# Altium schematic sheet modFOC-Sensing.SchDoc
size A4; DocumentNumber: 2; SheetNumber: 2; SheetTotal: 3
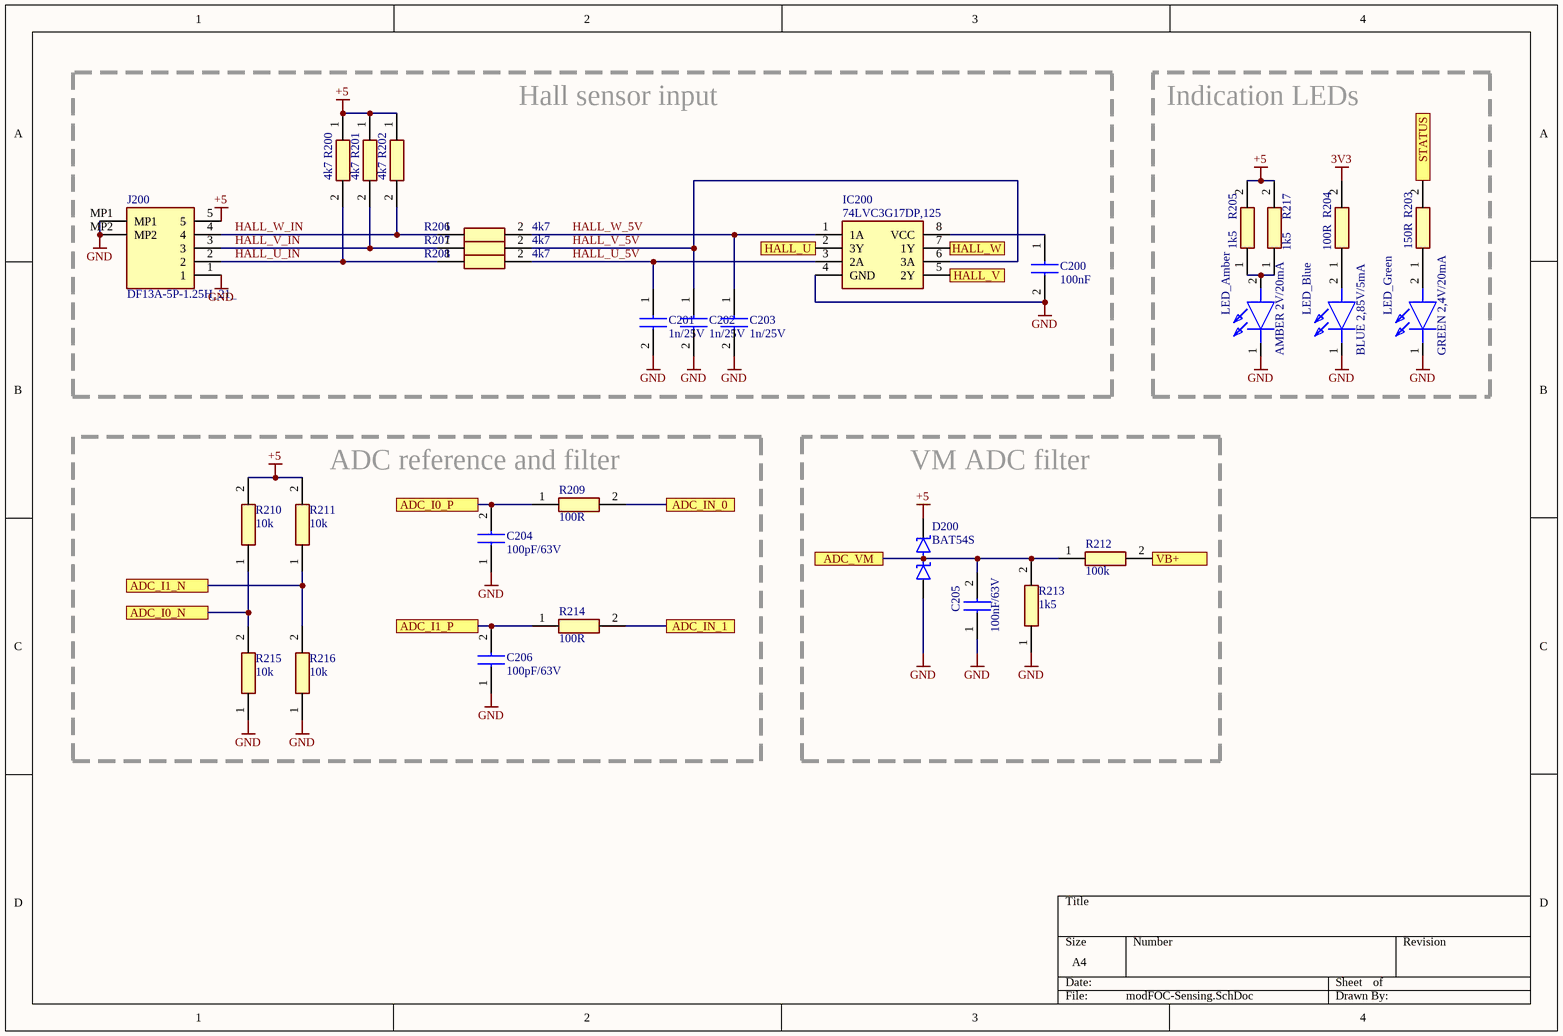
[diagram p0: modFOC-Sensing.SchDoc]

## Parts
C200  100nF  [CAPC1608X97N]
C201  1n/25V  [CAPC1608X97N]
C202  1n/25V  [CAPC1608X97N]
C203  1n/25V  [CAPC1608X97N]
C204  100pF/63V  [CAPC1608X87N]
C205  100nF/63V  [CAPC1608X97N]
C206  100pF/63V  [CAPC1608X87N]
D200  BAT54S  [SOT95P240X110-3N]
IC200  74LVC3G17DP,125  [SOP65P400X110-8N]
J200  DF13A-5P-1.25H_21_  [DF13A5P125H21]
LED_Amber  AMBER 2V/20mA  [LEDC1608X55N]
LED_Blue  BLUE 2,85V/5mA  [LEDC1608X40N]
LED_Green  GREEN 2,4V/20mA  [LGQ396PS35]
R200  4k7  [RESC1608X55N]
R201  4k7  [RESC1608X55N]
R202  4k7  [RESC1608X55N]
R203  150R  [RESC1608X55N]
R204  100R  [RESC1608X55N]
R205  1k5  [RESC1608X55N]
R206  4k7  [RESC1608X55N]
R207  4k7  [RESC1608X55N]
R208  4k7  [RESC1608X55N]
R209  100R  [RESC1608X55N]
R210  10k  [RESC1608X55N]
R211  10k  [RESC1608X55N]
R212  100k  [RESC1608X55N]
R213  1k5  [RESC1608X55N]
R214  100R  [RESC1608X55N]
R215  10k  [RESC1608X55N]
R216  10k  [RESC1608X55N]
R217  1k5  [RESC1608X55N]

## Blocks framed on the sheet
Hall sensor input: C200-C203 IC200 J200 R200-R202 R206-R208
Indication LEDs: LED_Amber LED_Blue LED_Green R203-R205 R217
ADC reference and filter: C204 C206 R209-R211 R214-R216
VM ADC filter: C205 D200 R212 R213

## Ports
ADC_I0_N, ADC_I0_P, ADC_I1_N, ADC_I1_P, ADC_IN_0, ADC_IN_1, ADC_VM, HALL_U, HALL_V, HALL_W, STATUS, VB+

## Nets
3V3: R204.2
+5: D200.2(K) J200.5 R200.1 R201.1 R202.1 R205.2 R210.2 R211.2 R217.2
GND: C200.2 C201.2 C202.2 C203.2 C204.1 C205.1 C206.1 D200.1(A) IC200.4(GND) J200.1 J200.MP1 J200.MP2 LED_Amber.1(K) LED_Blue.1(K) LED_Green.1(K) R213.1 R215.1 R216.1
ADC_I0_N: R210.1 R215.2 ; port ADC_I0_N
ADC_I0_P: C204.2 R209.1 ; port ADC_I0_P
ADC_I1_N: R211.1 R216.2 ; port ADC_I1_N
ADC_I1_P: C206.2 R214.1 ; port ADC_I1_P
ADC_IN_0: R209.2 ; port ADC_IN_0
ADC_IN_1: R214.2 ; port ADC_IN_1
ADC_VM: C205.2 D200.3(A/K) R212.1 R213.2 ; port ADC_VM
HALL_U: IC200.2(3Y) ; port HALL_U
HALL_U_5V: C201.1 IC200.3(2A) R208.2
HALL_U_IN: J200.2 R200.2 R208.1
HALL_V: IC200.5(2Y) ; port HALL_V
HALL_V_5V: C202.1 IC200.6(3A) R207.2
HALL_V_IN: J200.3 R201.2 R207.1
HALL_W: IC200.7(1Y) ; port HALL_W
HALL_W_5V: C203.1 IC200.1(1A) R206.2
HALL_W_IN: J200.4 R202.2 R206.1
STATUS: R203.2 ; port STATUS
VB+: R212.2 ; port VB+
NetC200_1: C200.1 IC200.8(VCC)
NetLED_Amber_2: LED_Amber.2(A) R205.1 R217.1
NetLED_Blue_2: LED_Blue.2(A) R204.1
NetLED_Green_2: LED_Green.2(A) R203.1

## Library data of the parts
C200 = VJ0603Y104JXJAC: Capacitor; Manufacturer_Name: Vishay; Datasheet Link: http://www.vishay.com/docs/45226/vj31xrohsautomlcc.pdf; Height: 0.97mm; Manufacturer_Part_Number: VJ0603Y104JXJAC; Mouser Part Number: 77-VJ0603Y104JXJAC; Mouser Price/Stock: https://www.mouser.com/Search/Refine.aspx?Keyword=77-VJ0603Y104JXJAC
C201-C203 = GRM033R71E102KA01D: Capacitor; Manufacturer_Name: Murata Electronics; Datasheet Link: https://psearch.en.murata.com/capacitor/product/GRM033R71E102KA01%23.html; Height: 0.33mm; Manufacturer_Part_Number: GRM033R71E102KA01D; Mouser Part Number: 81-GRM033R71E102KA1D; Mouser Price/Stock: https://www.mouser.co.uk/ProductDetail/Murata-Electronics/GRM033R71E102KA01D/?qs=%252BwCMEOx2S5vqymn%2Fc34U1A%3D%3D; Arrow Part Number: GRM033R71E102KA01D; Arrow Price/Stock: https://www.arrow.com/en/products/grm033r71e102ka01d/murata-manufacturing
C204 C206 = C0603C101K1HACTU: Capacitor; Manufacturer_Name: Kemet; Datasheet Link: https://www.mouser.com/datasheet/2/212/KEM_C1007_X8R_ULTRA_150C_SMD-1102703.pdf; Height: 0.87mm; Manufacturer_Part_Number: C0603C101K1HACTU; Mouser Part Number: 80-C0603C101K1HACTU; Mouser Price/Stock: https://www.mouser.co.uk/ProductDetail/KEMET/C0603C101K1HACTU?qs=W0yvOO0ixfE5G01qpfeqIQ%3D%3D
C205 = C0805C104MMREC7210: Capacitor; Manufacturer_Name: Vishay; Manufacturer_Part_Number: VJ0603Y104JXJAC; Datasheet Link: http://www.vishay.com/docs/45226/vj31xrohsautomlcc.pdf; Height: 1mm; Mouser Part Number: 77-VJ0603Y104JXJAC; Mouser Price/Stock: https://www.mouser.com/Search/Refine.aspx?Keyword=77-VJ0603Y104JXJAC
D200 = BAT54S: Schottky Diode; Manufacturer_Name: Rectron; Datasheet Link: https://www.rectron.com/data_sheets/bat54s.pdf; Height: 1.1mm; Manufacturer_Part_Number: BAT54S; Mouser Part Number: 583-BAT54S; Mouser Price/Stock: https://www.mouser.co.uk/ProductDetail/Rectron/BAT54S?qs=7pEAo90IqNGRiqD7TkybWA%3D%3D; Arrow Part Number: BAT54S; Arrow Price/Stock: https://www.arrow.com/en/products/bat54s/rectron
IC200 = 74LVC3G17DP,125: Integrated Circuit; Manufacturer_Name: Nexperia; Datasheet Link: https://assets.nexperia.com/documents/data-sheet/74LVC3G17.pdf; Height: 1.1mm; Manufacturer_Part_Number: 74LVC3G17DP,125; Mouser Part Number: 771-LVC3G17DP125; Mouser Price/Stock: https://www.mouser.co.uk/ProductDetail/Nexperia/74LVC3G17DP125?qs=me8TqzrmIYUUngWcw0uHGA%3D%3D; Arrow Part Number: 74LVC3G17DP,125; Arrow Price/Stock: https://www.arrow.com/en/products/74lvc3g17dp125/nexperia
J200 = DF13A-5P-1.25H_21_: Connector; Manufacturer_Name: Hirose; Manufacturer_Part_Number: DF13A-5P-1.25H(21); Datasheet Link: https://componentsearchengine.com/Datasheets/1/DF13A-5P-1.25H(21).pdf; Height: 3.75mm; Mouser Part Number: 798-DF13A5P125H21; Mouser Price/Stock: https://www.mouser.co.uk/ProductDetail/Hirose-Connector/DF13A-5P-125H21?qs=XQjbzJWzFPWvJsE2o%252B4Q8Q%3D%3D
LED_Amber = ASMT-RA45-AP932: LED; Manufacturer_Name: Avago Technologies; Datasheet Link: https://docs.broadcom.com/docs/AV02-0378EN; Height: 0.55mm; Manufacturer_Part_Number: ASMT-RA45-AP932; Mouser Part Number: 630-ASMT-RA45-AP932; Mouser Price/Stock: https://www.mouser.co.uk/ProductDetail/Broadcom-Avago/ASMT-RA45-AP932?qs=7zQgkplsu%2FO5gZneoB42ug%3D%3D
LED_Blue = LB_Q39G-L2OO-35-1: LED; Manufacturer_Name: OSRAM; Manufacturer_Part_Number: LB Q39G-L2OO-35-1; Datasheet Link: http://www.mouser.com/ds/2/311/LB Q39G - CHIPLED 0603-553388.pdf; Height: 0.4mm; Mouser Part Number: 720-LBQ39GL2N2351; Mouser Price/Stock: https://www.mouser.co.uk/ProductDetail/OSRAM-Opto-Semiconductors/LB-Q39G-L2OO-35-1?qs=74fRo9GAWsxvZBH6a5xY%252BA%3D%3D; Arrow Part Number: LB Q39G-L2OO-35-1; Arrow Price/Stock: https://www.arrow.com/en/products/lbq39g-l2oo-35-1/osram-opto-semiconductors
LED_Green = LG_Q396-PS-35: LED; Manufacturer_Name: OSRAM; Manufacturer_Part_Number: LG Q396-PS-35; Datasheet Link: https://mouser.componentsearchengine.com/Datasheets/2/LG%20Q396-PS-35.pdf; Height: 0.4mm; Mouser Part Number: 720-LGQ396A3964; Mouser Price/Stock: https://www.mouser.co.uk/ProductDetail/OSRAM-Opto-Semiconductors/LG-Q396-PS-35?qs=xC%252BE9h5iuX5%252BCocujXxOpw%3D%3D; Arrow Part Number: LG Q396-PS-35; Arrow Price/Stock: https://www.arrow.com/en/products/lgq396-ps-35/osram-opto-semiconductors
R200-R202 R206-R208 = CRCW06034K70JNEAC: Resistor; Manufacturer_Name: Vishay; Datasheet Link: http://www.vishay.com/docs/28773/crcwce3.pdf; Height: 0.55mm; Manufacturer_Part_Number: CRCW06034K70JNEAC; Mouser Part Number: 71-CRCW06034K70JNEAC; Mouser Price/Stock: https://www.mouser.co.uk/ProductDetail/Vishay-Dale/CRCW06034K70JNEAC/?qs=E3Y5ESvWgWMzBuUf0K3dnA%3D%3D; Arrow Part Number: CRCW06034K70JNEAC; Arrow Price/Stock: https://www.arrow.com/en/products/crcw06034k70jneac/vishay
R203 = SFR03EZPF1500: Resistor; Manufacturer_Name: ROHM Semiconductor; Datasheet Link: https://componentsearchengine.com/Datasheets/1/SFR03EZPF1500.pdf; Height: 0.55mm; Manufacturer_Part_Number: SFR03EZPF1500; Mouser Part Number: 755-SFR03EZPF1500; Mouser Price/Stock: https://www.mouser.com/Search/Refine.aspx?Keyword=755-SFR03EZPF1500
R204 R209 R214 = CRCW0603100RFKEAC: Resistor; Manufacturer_Name: Vishay; Datasheet Link: https://componentsearchengine.com/Datasheets/1/CRCW0603100RFKEAC.pdf; Height: 0.55mm; Manufacturer_Part_Number: CRCW0603100RFKEAC; Mouser Part Number: 71-CRCW0603100RFKEAC; Mouser Price/Stock: https://www.mouser.co.uk/ProductDetail/Vishay-Dale/CRCW0603100RFKEAC/?qs=E3Y5ESvWgWPJqb4%2F19sAKw%3D%3D; Arrow Part Number: CRCW0603100RFKEAC; Arrow Price/Stock: https://www.arrow.com/en/products/crcw0603100rfkeac/vishay
R205 R213 R217 = ERJ1GNF1501C: Resistor; Manufacturer_Name: Panasonic; Datasheet Link: https://industrial.panasonic.com/cdbs/www-data/pdf/RDA0000/AOA0000C84.pdf; Height: 0.26mm; Manufacturer_Part_Number: ERJ1GNF1501C
R210 R211 R215 R216 = RC0603FR-0710KL: Resistor; Manufacturer_Name: YAGEO (PHYCOMP); Datasheet Link: http://www.yageo.com/documents/recent/PYu-RC0603_51_RoHS_L_v5.pdf; Height: 0.55mm; Manufacturer_Part_Number: RC0603FR-0710KL; Arrow Part Number: RC0603FR-0710KL; Arrow Price/Stock: https://www.arrow.com/en/products/rc0603fr-0710kl/yageo; Mouser Part Number: 603-RC0603FR-0710KL; Mouser Price/Stock: https://www.mouser.co.uk/ProductDetail/Yageo/RC0603FR-0710KL?qs=grNVn54RoB%252B3GtjbJj3wJQ%3D%3D
R212 = ERJ1GNF1003C: Resistor; Manufacturer_Name: Panasonic; Datasheet Link: https://industrial.panasonic.com/cdbs/www-data/pdf/RDA0000/AOA0000C84.pdf; Height: 0.26mm; Manufacturer_Part_Number: ERJ1GNF1003C; Arrow Part Number: ERJ1GNF1003C; Arrow Price/Stock: https://www.arrow.com/en/products/erj1gnf1003c/panasonic